# Altium project W2-Tuner_7x7.PrjPcb
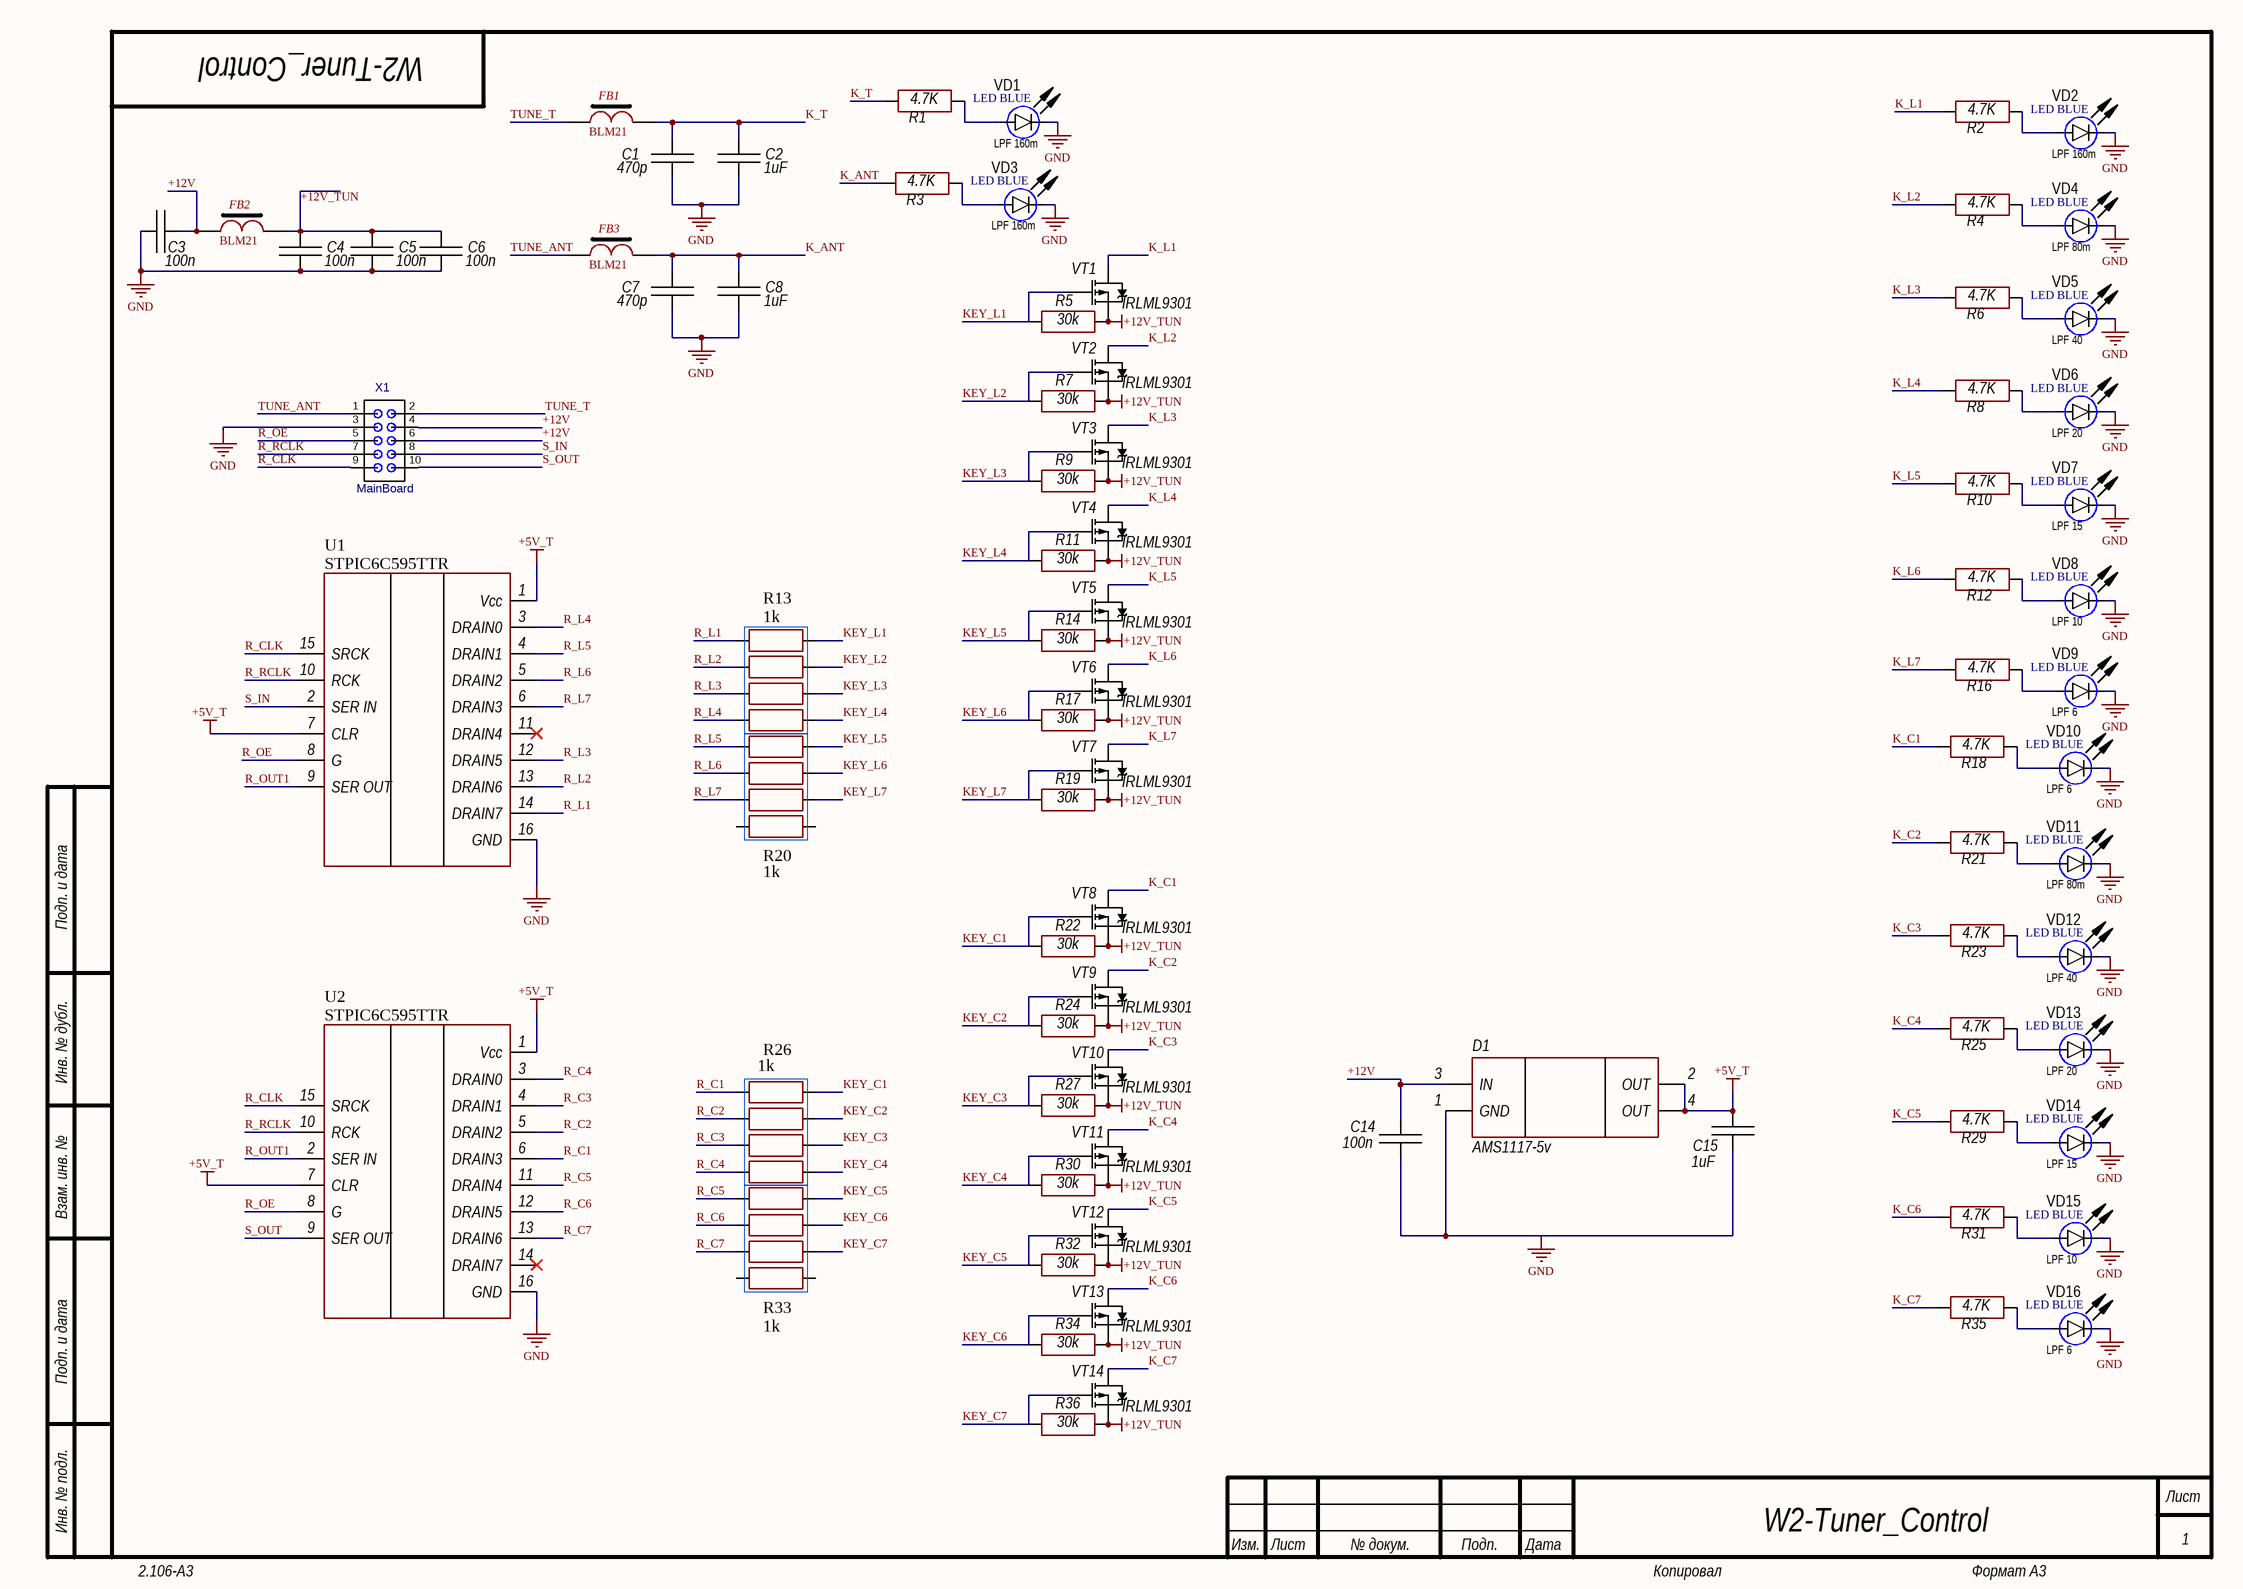
[diagram p0: TUN7_Control.SchDoc]
2 sheets, 144 parts. Net scope: global (net labels, ports and power ports of the same name join across sheets).
Board file: TUN7_PCB.PcbDoc
Sheets:
  TUN7_Control.SchDoc
  TUN7_Main.SchDoc

## Sheet TUN7_Control.SchDoc
size 420 x 297 mm; Date: 04/03/2023; CheckedBy: UA3REO; Author: RU4PN; DrawnBy: UA3REO; DocumentNumber: W2-Tuner_Control; SheetNumber: 1; SheetTotal: 2; Time: 23:01

### Parts
C1  470p  [CH0805C]
C2  1uF  [CH0805C]
C3  100n  [CH0805C]
C4  100n  [CH0805C]
C5  100n  [CH0805C]
C6  100n  [CH0805C]
C7  470p  [CH0805C]
C8  1uF  [CH0805C]
C14  100n  [CH0805C]
C15  1uF  [CH0805C]
D1  AMS1117-5v  [SOT223]
FB1  BLM21  [CH0805L]
FB2  BLM21  [CH0805L]
FB3  BLM21  [CH0805L]
R1  4.7K  [CH0805R]
R2  4.7K  [CH0805R]
R3  4.7K  [CH0805R]
R4  4.7K  [CH0805R]
R5  30k  [CH0805R]
R6  4.7K  [CH0805R]
R7  30k  [CH0805R]
R8  4.7K  [CH0805R]
R9  30k  [CH0805R]
R10  4.7K  [CH0805R]
R11  30k  [CH0805R]
R12  4.7K  [CH0805R]
R13  1k  [CAT16]
R14  30k  [CH0805R]
R16  4.7K  [CH0805R]
R17  30k  [CH0805R]
R18  4.7K  [CH0805R]
R19  30k  [CH0805R]
R20  1k  [CAT16]
R21  4.7K  [CH0805R]
R22  30k  [CH0805R]
R23  4.7K  [CH0805R]
R24  30k  [CH0805R]
R25  4.7K  [CH0805R]
R26  1k  [CAT16]
R27  30k  [CH0805R]
R29  4.7K  [CH0805R]
R30  30k  [CH0805R]
R31  4.7K  [CH0805R]
R32  30k  [CH0805R]
R33  1k  [CAT16]
R34  30k  [CH0805R]
R35  4.7K  [CH0805R]
R36  30k  [CH0805R]
U1  STPIC6C595TTR  [16-TSOP]
U2  STPIC6C595TTR  [16-TSOP]
VD1  LED BLUE  Color: LPF 160m  [LED: 0805B]
VD2  LED BLUE  Color: LPF 160m  [LED: 0805B]
VD3  LED BLUE  Color: LPF 160m  [LED: 0805B]
VD4  LED BLUE  Color: LPF 80m  [LED: 0805B]
VD5  LED BLUE  Color: LPF 40  [LED: 0805B]
VD6  LED BLUE  Color: LPF 20  [LED: 0805B]
VD7  LED BLUE  Color: LPF 15  [LED: 0805B]
VD8  LED BLUE  Color: LPF 10  [LED: 0805B]
VD9  LED BLUE  Color: LPF 6  [LED: 0805B]
VD10  LED BLUE  Color: LPF 6  [LED: 0805B]
VD11  LED BLUE  Color: LPF 80m  [LED: 0805B]
VD12  LED BLUE  Color: LPF 40  [LED: 0805B]
VD13  LED BLUE  Color: LPF 20  [LED: 0805B]
VD14  LED BLUE  Color: LPF 15  [LED: 0805B]
VD15  LED BLUE  Color: LPF 10  [LED: 0805B]
VD16  LED BLUE  Color: LPF 6  [LED: 0805B]
VT1  IRLML9301  [SOT23_132]
VT2  IRLML9301  [SOT23_132]
VT3  IRLML9301  [SOT23_132]
VT4  IRLML9301  [SOT23_132]
VT5  IRLML9301  [SOT23_132]
VT6  IRLML9301  [SOT23_132]
VT7  IRLML9301  [SOT23_132]
VT8  IRLML9301  [SOT23_132]
VT9  IRLML9301  [SOT23_132]
VT10  IRLML9301  [SOT23_132]
VT11  IRLML9301  [SOT23_132]
VT12  IRLML9301  [SOT23_132]
VT13  IRLML9301  [SOT23_132]
VT14  IRLML9301  [SOT23_132]
X1  MainBoard  [CON: BH-10]

### Nets
+5V_T: C15.2 D1.2(OUT) D1.4(OUT) U1.1(Vcc) U1.7(CLR) U2.1(Vcc) U2.7(CLR)
+12V_TUN: C4.2 C5.2 C6.2 FB2.1 R5.1 R7.1 R9.1 R11.1 R14.1 R17.1 R19.1 R22.1 R24.1 R27.1 R30.1 R32.1 R34.1 R36.1 VT1.2(S) VT2.2(S) VT3.2(S) VT4.2(S) VT5.2(S) VT6.2(S) VT7.2(S) VT8.2(S) VT9.2(S) VT10.2(S) VT11.2(S) VT12.2(S) VT13.2(S) VT14.2(S)
GND: C1.2 C2.2 C3.1 C4.1 C5.1 C6.1 C7.2 C8.2 C14.1 C15.1 D1.1(GND) U1.16(GND) U2.16(GND) VD1.2(C) VD2.2(C) VD3.2(C) VD4.2(C) VD5.2(C) VD6.2(C) VD7.2(C) VD8.2(C) VD9.2(C) VD10.2(C) VD11.2(C) VD12.2(C) VD13.2(C) VD14.2(C) VD15.2(C) VD16.2(C) X1.3
+12V: C3.2 C14.2 D1.3(IN) FB2.2 X1.4 X1.6
K_ANT: C7.1 C8.1 FB3.1 R3.2
K_C1: R18.2 VT8.3(D)
K_C2: R21.2 VT9.3(D)
K_C3: R23.2 VT10.3(D)
K_C4: R25.2 VT11.3(D)
K_C5: R29.2 VT12.3(D)
K_C6: R31.2 VT13.3(D)
K_C7: R35.2 VT14.3(D)
K_L1: R2.2 VT1.3(D)
K_L2: R4.2 VT2.3(D)
K_L3: R6.2 VT3.3(D)
K_L4: R8.2 VT4.3(D)
K_L5: R10.2 VT5.3(D)
K_L6: R12.2 VT6.3(D)
K_L7: R16.2 VT7.3(D)
K_T: C1.1 C2.1 FB1.1 R1.2
KEY_C1: R22.2 R26.5 VT8.1(G)
KEY_C2: R24.2 R26.6 VT9.1(G)
KEY_C3: R26.7 R27.2 VT10.1(G)
KEY_C4: R26.8 R30.2 VT11.1(G)
KEY_C5: R32.2 R33.5 VT12.1(G)
KEY_C6: R33.6 R34.2 VT13.1(G)
KEY_C7: R33.7 R36.2 VT14.1(G)
KEY_L1: R5.2 R13.5 VT1.1(G)
KEY_L2: R7.2 R13.6 VT2.1(G)
KEY_L3: R9.2 R13.7 VT3.1(G)
KEY_L4: R11.2 R13.8 VT4.1(G)
KEY_L5: R14.2 R20.5 VT5.1(G)
KEY_L6: R17.2 R20.6 VT6.1(G)
KEY_L7: R19.2 R20.7 VT7.1(G)
R_C1: R26.1 U2.6(DRAIN3)
R_C2: R26.2 U2.5(DRAIN2)
R_C3: R26.3 U2.4(DRAIN1)
R_C4: R26.4 U2.3(DRAIN0)
R_C5: R33.1 U2.11(DRAIN4)
R_C6: R33.2 U2.12(DRAIN5)
R_C7: R33.3 U2.13(DRAIN6)
R_CLK: U1.15(SRCK) U2.15(SRCK) X1.9
R_L1: R13.1 U1.14(DRAIN7)
R_L2: R13.2 U1.13(DRAIN6)
R_L3: R13.3 U1.12(DRAIN5)
R_L4: R13.4 U1.3(DRAIN0)
R_L5: R20.1 U1.4(DRAIN1)
R_L6: R20.2 U1.5(DRAIN2)
R_L7: R20.3 U1.6(DRAIN3)
R_OE: U1.8(G) U2.8(G) X1.5
R_OUT1: U1.9(SER_OUT) U2.2(SER_IN)
R_RCLK: U1.10(RCK) U2.10(RCK) X1.7
S_IN: U1.2(SER_IN) X1.8
S_OUT: U2.9(SER_OUT) X1.10
TUNE_ANT: FB3.2 X1.1
TUNE_T: FB1.2 X1.2
NetR1_1: R1.1 VD1.1(A)
NetR2_1: R2.1 VD2.1(A)
NetR3_1: R3.1 VD3.1(A)
NetR4_1: R4.1 VD4.1(A)
NetR6_1: R6.1 VD5.1(A)
NetR8_1: R8.1 VD6.1(A)
NetR10_1: R10.1 VD7.1(A)
NetR12_1: R12.1 VD8.1(A)
NetR16_1: R16.1 VD9.1(A)
NetR18_1: R18.1 VD10.1(A)
NetR21_1: R21.1 VD11.1(A)
NetR23_1: R23.1 VD12.1(A)
NetR25_1: R25.1 VD13.1(A)
NetR29_1: R29.1 VD14.1(A)
NetR31_1: R31.1 VD15.1(A)
NetR35_1: R35.1 VD16.1(A)

Not connected (* = marked no-connect by the designer): R20 4 8; R33 4 8; U1 11(DRAIN4)*; U2 14(DRAIN7)*

### Notes on the sheet
- Подп. и дата
- Инв. № дубл.
- Взам. инв. №
- Инв. № подл.
- Изм.
- Лист
- № докум.
- Подп.
- Дата
- 2.106-A3
- Копировал
- Формат А3

### Library data of the parts
C1-C8 C14 C15 = Capacitor: Manufacturer: *; Model: *; HelpURL: *; ComponentKind: *; Value: *
D1 = NCP1117LPST50T3G: LDO; Manufacturer: ON Semiconductor; Model: NCP1117LPST50T3G; HelpURL: https://www.digikey.com/product-detail/en/on-semiconductor/NCP1117LPST50T3G/NCP1117LPST50T3GOSCT-ND/5801728; ComponentKind: SOT-223
FB1-FB3 = FB-1
R1-R12 R14 R16-R19 R21-R25 R27 R29-R32 R34-R36 = Resistor: Manufacturer: *; Model: *; HelpURL: *; ComponentKind: *; Value: *
R13 R20 R26 R33 = CAT10-0804
VD1-VD16 = LED_single: ValueManufacturerPartNumber: LED, *, *, *, -55...+150°C; Manufacturer: *; Package: *; HelpURL: *; Temperature: -55...+150°C; TypeDiode: LED; Current: *; VoltageDrop: *; PartNumber: *
VT1-VT14 = IRLML9301: Mosfet; Model: *; Manufacturer: *; ComponentKind: *; HelpURL: *
X1 = IDC10: 2*5 Pin

## Sheet TUN7_Main.SchDoc
size 594 x 420 mm; Author: RU4PN; CompanyName: Wolf Team; DocumentNumber: W2 - Tuner - Main; SheetNumber: 2; SheetTotal: 2
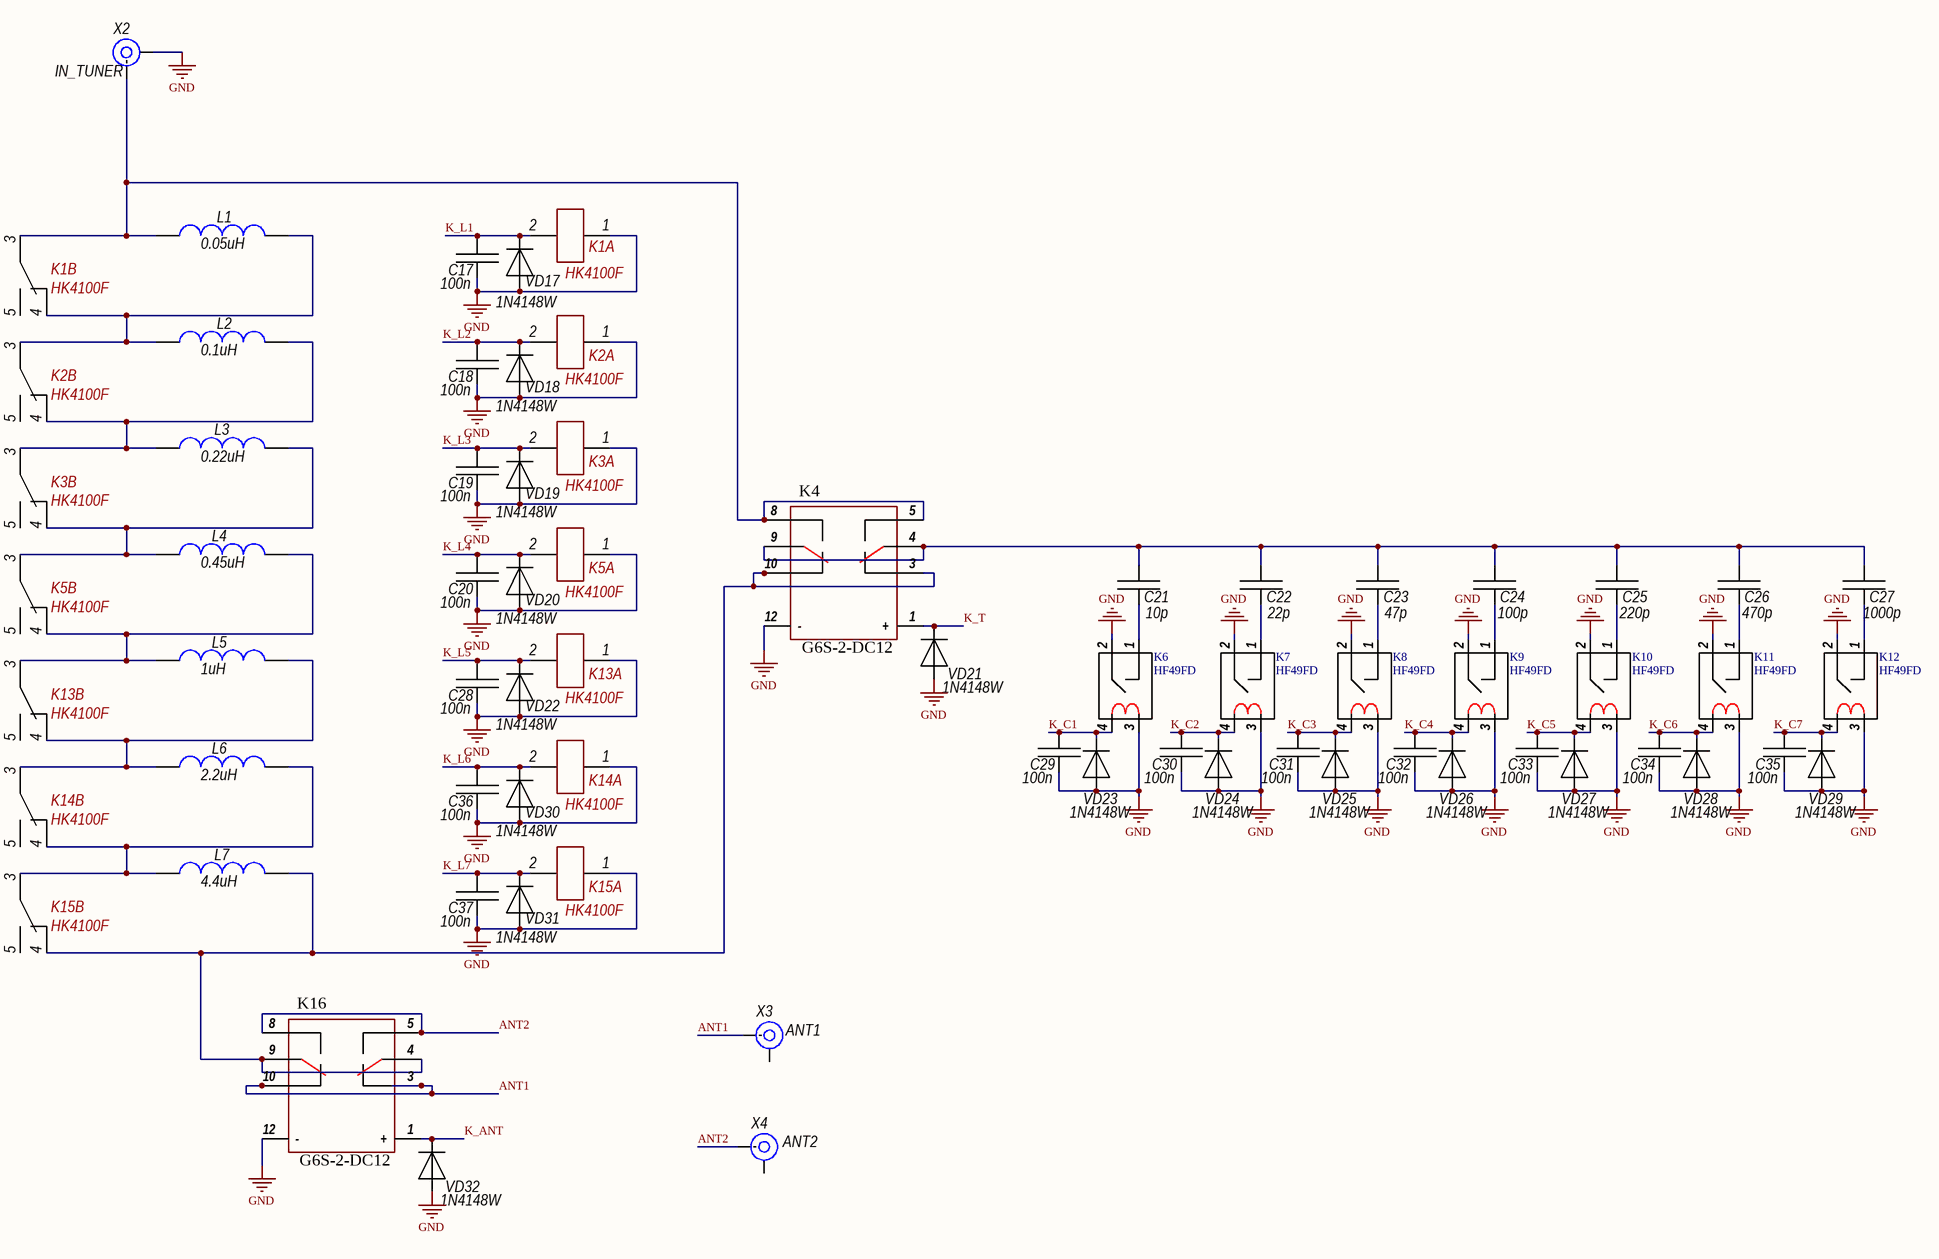
[diagram p1: TUN7_Main.SchDoc]

### Parts
C17  100n  [CH0805C]
C18  100n  [CH0805C]
C19  100n  [CH0805C]
C20  100n  [CH0805C]
C21  10p  [CH1206ATC]
C22  22p  [CH1206ATC]
C23  47p  [CH1206ATC]
C24  100p  [CH1206ATC]
C25  220p  [CH1206ATC]
C26  470p  [CH1206ATC]
C27  1000p  [CH1206ATC]
C28  100n  [CH0805C]
C29  100n  [CH0805C]
C30  100n  [CH0805C]
C31  100n  [CH0805C]
C32  100n  [CH0805C]
C33  100n  [CH0805C]
C34  100n  [CH0805C]
C35  100n  [CH0805C]
C36  100n  [CH0805C]
C37  100n  [CH0805C]
K1  HK4100F  [NK4100F]  (parts A,B of 2)
K2  HK4100F  [NK4100F]  (parts A,B of 2)
K3  HK4100F  [NK4100F]  (parts A,B of 2)
K4  G6S-2-DC12  [G6S-2-DC12]
K5  HK4100F  [NK4100F]  (parts A,B of 2)
K6  HF49FD  [HF49FD]
K7  HF49FD  [HF49FD]
K8  HF49FD  [HF49FD]
K9  HF49FD  [HF49FD]
K10  HF49FD  [HF49FD]
K11  HF49FD  [HF49FD]
K12  HF49FD  [HF49FD]
K13  HK4100F  [NK4100F]  (parts A,B of 2)
K14  HK4100F  [NK4100F]  (parts A,B of 2)
K15  HK4100F  [NK4100F]  (parts A,B of 2)
K16  G6S-2-DC12  [G6S-2-DC12]
L1  0.05uH  [DR1]
L2  0.1uH  [DR1]
L3  0.22uH  [DR1]
L4  0.45uH  [T68-0]
L5  1uH  [T68-0]
L6  2.2uH  [T68-0]
L7  4.4uH  [T68-0]
VD17  1N4148W  [SOD123]
VD18  1N4148W  [SOD123]
VD19  1N4148W  [SOD123]
VD20  1N4148W  [SOD123]
VD21  1N4148W  [SOD123]
VD22  1N4148W  [SOD123]
VD23  1N4148W  [SOD123]
VD24  1N4148W  [SOD123]
VD25  1N4148W  [SOD123]
VD26  1N4148W  [SOD123]
VD27  1N4148W  [SOD123]
VD28  1N4148W  [SOD123]
VD29  1N4148W  [SOD123]
VD30  1N4148W  [SOD123]
VD31  1N4148W  [SOD123]
VD32  1N4148W  [SOD123]
X2  IN_TUNER  [CON: SMA]
X3  ANT1  [CON: SMA]
X4  ANT2  [CON: SMA]

### Nets
GND: C17.2 C18.2 C19.2 C20.2 C28.2 C29.2 C30.2 C31.2 C32.2 C33.2 C34.2 C35.2 C36.2 C37.2 K1.1 K2.1 K3.1 K4.12(-) K5.1 K6.2 K6.3 K7.2 K7.3 K8.2 K8.3 K9.2 K9.3 K10.2 K10.3 K11.2 K11.3 K12.2 K12.3 K13.1 K14.1 K15.1 K16.12(-) VD17.1 VD18.1 VD19.1 VD20.1 VD21.1 VD22.1 VD23.1 VD24.1 VD25.1 VD26.1 VD27.1 VD28.1 VD29.1 VD30.1 VD31.1 VD32.1 X2.2(IN)
ANT1: K16.3(NC_1) K16.10(NC_2) X3.1(IN)
ANT2: K16.5(NO_1) K16.8(NO_2) X4.1(IN)
K_ANT: K16.1(+) VD32.2
K_C1: C29.1 K6.4 VD23.2
K_C2: C30.1 K7.4 VD24.2
K_C3: C31.1 K8.4 VD25.2
K_C4: C32.1 K9.4 VD26.2
K_C5: C33.1 K10.4 VD27.2
K_C6: C34.1 K11.4 VD28.2
K_C7: C35.1 K12.4 VD29.2
K_L1: C17.1 K1.2 VD17.2
K_L2: C18.1 K2.2 VD18.2
K_L3: C19.1 K3.2 VD19.2
K_L4: C20.1 K5.2 VD20.2
K_L5: C28.1 K13.2 VD22.2
K_L6: C36.1 K14.2 VD30.2
K_L7: C37.1 K15.2 VD31.2
K_T: K4.1(+) VD21.2
NetC21_1: C21.1 C22.1 C23.1 C24.1 C25.1 C26.1 C27.1 K4.4(COM_1) K4.9(COM_2)
NetC21_2: C21.2 K6.1
NetC22_2: C22.2 K7.1
NetC23_2: C23.2 K8.1
NetC24_2: C24.2 K9.1
NetC25_2: C25.2 K10.1
NetC26_2: C26.2 K11.1
NetC27_2: C27.2 K12.1
NetK1_3: K1.3 K4.5(NO_1) K4.8(NO_2) L1.2 X2.1(IN)
NetK1_4: K1.4 K2.3 L1.1 L2.2
NetK2_4: K2.4 K3.3 L2.1 L3.2
NetK3_4: K3.4 K5.3 L3.1 L4.2
NetK4_3: K4.3(NC_1) K4.10(NC_2) K15.4 K16.4(COM_1) K16.9(COM_2) L7.1
NetK5_4: K5.4 K13.3 L4.1 L5.2
NetK13_4: K13.4 K14.3 L5.1 L6.2
NetK14_4: K14.4 K15.3 L6.1 L7.2

Not connected (* = marked no-connect by the designer): K1 5; K2 5; K3 5; K5 5; K13 5; K14 5; K15 5; X3 2(IN); X4 2(IN)

### Notes on the sheet
- Перв. примен.
- Справ. №
- Подп. и дата
- Инв. № дубл.
- Взам. инв. №
- Инв. № подл.
- Изм.
- Лист
- № докум.
- Подп.
- Дата
- 2.106-A2
- Копировал
- Формат А2

### Library data of the parts
C17-C37 = Capacitor: Manufacturer: *; Model: *; HelpURL: *; ComponentKind: *; Value: *
K1-K3 K5 K13-K15 = NK4100F
K4 K16 = G6S-2-DC12V_2
K6-K12 = HF49FD 012-1H12
L1-L7 = Inductor ring: Value: {Value}; Model: *; ComponentKind: *; Manufacturer: *; HelpURL: *
VD17-VD32 = Diod: ComponentKind: *; Manufacturer: *; Model: *; HelpURL: *
X2-X4 = SMA: RF; Model: *; Manufacturer: *; HelpURL: *; ComponentKind: *

## Nets that join several sheets
GND: TUN7_Control (30 pins), TUN7_Main (54 pins)
K_ANT: TUN7_Control (C7.1 C8.1 FB3.1 R3.2), TUN7_Main (K16.1 VD32.2)
K_C1: TUN7_Control (R18.2 VT8.3), TUN7_Main (C29.1 K6.4 VD23.2)
K_C2: TUN7_Control (R21.2 VT9.3), TUN7_Main (C30.1 K7.4 VD24.2)
K_C3: TUN7_Control (R23.2 VT10.3), TUN7_Main (C31.1 K8.4 VD25.2)
K_C4: TUN7_Control (R25.2 VT11.3), TUN7_Main (C32.1 K9.4 VD26.2)
K_C5: TUN7_Control (R29.2 VT12.3), TUN7_Main (C33.1 K10.4 VD27.2)
K_C6: TUN7_Control (R31.2 VT13.3), TUN7_Main (C34.1 K11.4 VD28.2)
K_C7: TUN7_Control (R35.2 VT14.3), TUN7_Main (C35.1 K12.4 VD29.2)
K_L1: TUN7_Control (R2.2 VT1.3), TUN7_Main (C17.1 K1.2 VD17.2)
K_L2: TUN7_Control (R4.2 VT2.3), TUN7_Main (C18.1 K2.2 VD18.2)
K_L3: TUN7_Control (R6.2 VT3.3), TUN7_Main (C19.1 K3.2 VD19.2)
K_L4: TUN7_Control (R8.2 VT4.3), TUN7_Main (C20.1 K5.2 VD20.2)
K_L5: TUN7_Control (R10.2 VT5.3), TUN7_Main (C28.1 K13.2 VD22.2)
K_L6: TUN7_Control (R12.2 VT6.3), TUN7_Main (C36.1 K14.2 VD30.2)
K_L7: TUN7_Control (R16.2 VT7.3), TUN7_Main (C37.1 K15.2 VD31.2)
K_T: TUN7_Control (C1.1 C2.1 FB1.1 R1.2), TUN7_Main (K4.1 VD21.2)